# EAGLE schematic matrix_4x4 (EAGLE 8.3.1)
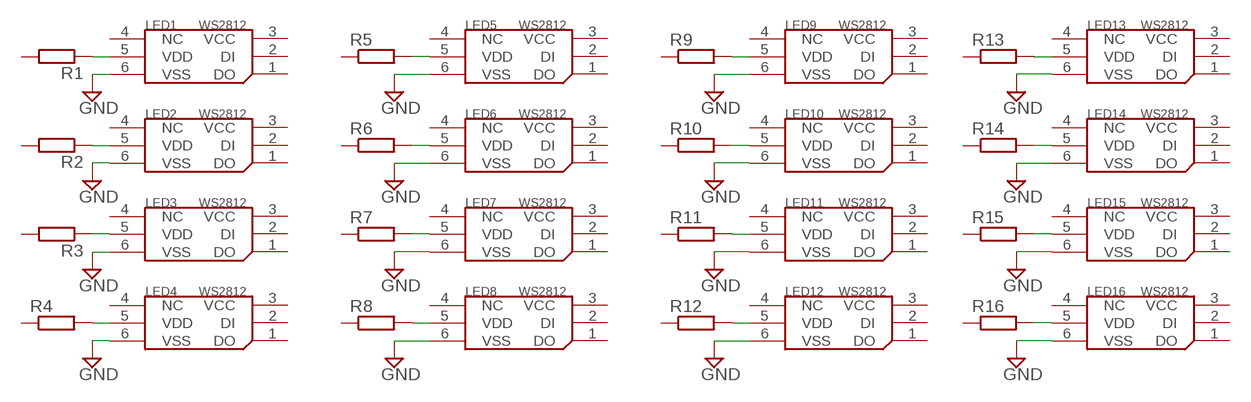
[diagram p0: schematic, sheet 1]

## Parts
LED1  WS2812  [LED6-SMD-5050]
LED2  WS2812  [LED6-SMD-5050]
LED3  WS2812  [LED6-SMD-5050]
LED4  WS2812  [LED6-SMD-5050]
LED5  WS2812  [LED6-SMD-5050]
LED6  WS2812  [LED6-SMD-5050]
LED7  WS2812  [LED6-SMD-5050]
LED8  WS2812  [LED6-SMD-5050]
LED9  WS2812  [LED6-SMD-5050]
LED10  WS2812  [LED6-SMD-5050]
LED11  WS2812  [LED6-SMD-5050]
LED12  WS2812  [LED6-SMD-5050]
LED13  WS2812  [LED6-SMD-5050]
LED14  WS2812  [LED6-SMD-5050]
LED15  WS2812  [LED6-SMD-5050]
LED16  WS2812  [LED6-SMD-5050]
R1  R-EU_M0805  [M0805]
R2  R-EU_M0805  [M0805]
R3  R-EU_M0805  [M0805]
R4  R-EU_M0805  [M0805]
R5  R-EU_M0805  [M0805]
R6  R-EU_M0805  [M0805]
R7  R-EU_M0805  [M0805]
R8  R-EU_M0805  [M0805]
R9  R-EU_M0805  [M0805]
R10  R-EU_M0805  [M0805]
R11  R-EU_M0805  [M0805]
R12  R-EU_M0805  [M0805]
R13  R-EU_M0805  [M0805]
R14  R-EU_M0805  [M0805]
R15  R-EU_M0805  [M0805]
R16  R-EU_M0805  [M0805]

## Nets
GND: LED1.6(VSS) LED2.6(VSS) LED3.6(VSS) LED4.6(VSS) LED5.6(VSS) LED6.6(VSS) LED7.6(VSS) LED8.6(VSS) LED9.6(VSS) LED10.6(VSS) LED11.6(VSS) LED12.6(VSS) LED13.6(VSS) LED14.6(VSS) LED15.6(VSS) LED16.6(VSS)
N$1: LED12.5(VDD) R12.2
N$2: LED1.5(VDD) R1.1
N$3: LED2.5(VDD) R2.1
N$4: LED3.5(VDD) R3.1
N$5: LED4.5(VDD) R4.2
N$6: LED8.5(VDD) R8.2
N$7: LED7.5(VDD) R7.2
N$8: LED6.5(VDD) R6.2
N$9: LED5.5(VDD) R5.2
N$10: LED9.5(VDD) R9.2
N$11: LED10.5(VDD) R10.2
N$12: LED11.5(VDD) R11.2
N$13: LED16.5(VDD) R16.2
N$14: LED15.5(VDD) R15.2
N$15: LED14.5(VDD) R14.2
N$16: LED13.5(VDD) R13.2
Unconnected: LED1.1(DO) LED1.2(DI) LED1.3(VCC) LED1.4(NC) LED2.1(DO) LED2.2(DI) LED2.3(VCC) LED2.4(NC) LED3.1(DO) LED3.2(DI) LED3.3(VCC) LED3.4(NC) LED4.1(DO) LED4.2(DI) LED4.3(VCC) LED4.4(NC) LED5.1(DO) LED5.2(DI) LED5.3(VCC) LED5.4(NC) LED6.1(DO) LED6.2(DI) LED6.3(VCC) LED6.4(NC) LED7.1(DO) LED7.2(DI) LED7.3(VCC) LED7.4(NC) LED8.1(DO) LED8.2(DI) LED8.3(VCC) LED8.4(NC) LED9.1(DO) LED9.2(DI) LED9.3(VCC) LED9.4(NC) LED10.1(DO) LED10.2(DI) LED10.3(VCC) LED10.4(NC) LED11.1(DO) LED11.2(DI) LED11.3(VCC) LED11.4(NC) LED12.1(DO) LED12.2(DI) LED12.3(VCC) LED12.4(NC) LED13.1(DO) LED13.2(DI) LED13.3(VCC) LED13.4(NC) LED14.1(DO) LED14.2(DI) LED14.3(VCC) LED14.4(NC) LED15.1(DO) LED15.2(DI) LED15.3(VCC) LED15.4(NC) LED16.1(DO) LED16.2(DI) LED16.3(VCC) LED16.4(NC) R1.2 R2.2 R3.2 R4.1 R5.1 R6.1 R7.1 R8.1 R9.1 R10.1 R11.1 R12.1 R13.1 R14.1 R15.1 R16.1

## Library data of the parts
LED1-LED16 = SMD-LED-ADDRESSABLE-RGB_6P-5X5MM_:WS2812; MP: WS2812
R1-R16 = rcl:R-EU_: RESISTOR, European symbol